# EAGLE design PCB (EAGLE 9.6.2)
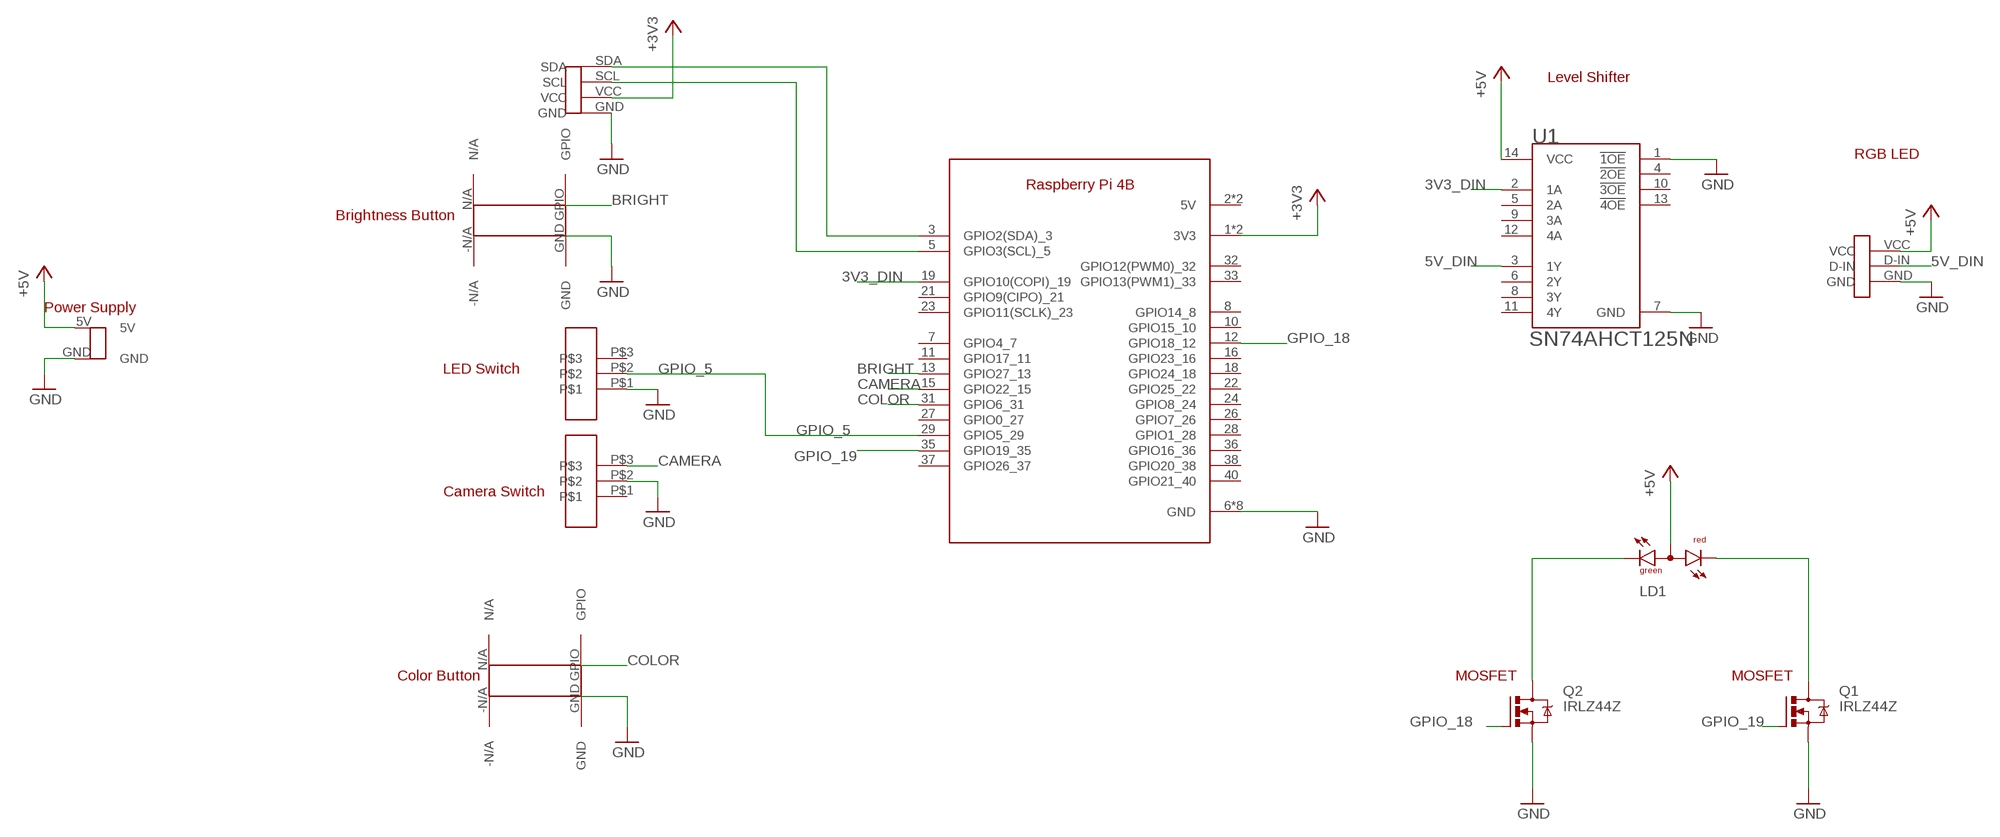
[diagram p0: schematic, sheet 1]

## Parts
LD1  DUOLED-RG-A  [DUOLED-A-5MM]
Q1  IRLZ44Z  [TO220BH]
Q2  IRLZ44Z  [TO220BH]
U1  TEXAS_INSTRUMENTS_SN74AHCT125NTEXAS_INSTRUMENTS_SN74AHCT125N_0_0  [TEXAS_INSTRUMENTS_SN74AHCT125N_0]
U$1  RASPBERRY_PI_4  [RASPI_4B]
U$2  G13-SW  [G13-SW]
U$3  G13-SW  [G13-SW]
U$4  LIGHTSENSOR-PO  [LIGHTSENSOR-IO]
U$5  LED-STRIP-PO  [LED-STRIP-PO]
U$6  G13-BUTTON  [G13-BUTTON]
U$7  G13-BUTTON  [G13-BUTTON]
U$8  G13-BATTERY  [G13-BATTERY]

## Nets
3V3_DIN: U1.2(1A) U$1.19(GPIO10(COPI)_19)
5V_DIN: U1.3(1Y) U$5.D-IN
+3V3: U$1.1(3V3) U$1.17(3V3) U$4.VCC
+5V: LD1.A U1.14(VCC) U$5.VCC U$8.5V
BRIGHT: U$1.13(GPIO27_13) U$6.GPIO
CAMERA: U$1.15(GPIO22_15) U$3.P$3
COLOR: U$1.31(GPIO6_31) U$7.GPIO
GND: Q1.S Q2.S U1.1(!1OE!) U1.7(GND) U$1.6(GND) U$1.9(GND) U$1.14(GND) U$1.20(GND) U$1.25(GND) U$1.30(GND) U$1.34(GND) U$1.39(GND) U$2.P$1 U$3.P$2 U$4.GND U$5.GND U$6.GND U$7.GND U$8.GND
GPIO_5: U$1.29(GPIO5_29) U$2.P$2
GPIO_18: Q2.G U$1.12(GPIO18_12)
GPIO_19: Q1.G U$1.35(GPIO19_35)
N$1: U$1.3(GPIO2(SDA)_3) U$4.SDA
N$2: U$1.5(GPIO3(SCL)_5) U$4.SCL
N$3: LD1.CR Q1.D
N$12: LD1.CX(CG) Q2.D
Unconnected: U1.4(!2OE!) U1.5(2A) U1.6(2Y) U1.8(3Y) U1.9(3A) U1.10(!3OE!) U1.11(4Y) U1.12(4A) U1.13(!4OE!) U$1.2(5V) U$1.4(5V) U$1.7(GPIO4_7) U$1.8(GPIO14_8) U$1.10(GPIO15_10) U$1.11(GPIO17_11) U$1.16(GPIO23_16) U$1.18(GPIO24_18) U$1.21(GPIO9(CIPO)_21) U$1.22(GPIO25_22) U$1.23(GPIO11(SCLK)_23) U$1.24(GPIO8_24) U$1.26(GPIO7_26) U$1.27(GPIO0_27) U$1.28(GPIO1_28) U$1.32(GPIO12(PWM0)_32) U$1.33(GPIO13(PWM1)_33) U$1.36(GPIO16_36) U$1.37(GPIO26_37) U$1.38(GPIO20_38) U$1.40(GPIO21_40) U$2.P$3 U$3.P$1 U$6.-N/A U$6.N/A U$7.-N/A U$7.N/A

## Notes on the sheet
- Level Shifter
- RGB LED
- Brightness Button
- Power Supply
- LED Switch
- Camera Switch
- Color Button | MOSFET | MOSFET

## Library data of the parts
LD1 = led:DUOLED-RG-A: DUO LED 2 colors (red/green), 5 mm, round, common Anode www.ligitek.com or other producers.
Q1 Q2 = transistor-power:IRLZ44Z: N-Channel HEXFET® Power MOSFET Logic Level AUTOMOTIVE MOSFET Source: http://www.irf.com/product-info/datasheets/data/irlz44zpbf.pdf
U1 = Texas Instruments - SN74AHCT125N:TEXAS_INSTRUMENTS_SN74AHCT125N: QUADRUPLE BUS BUFFER GATES WITH 3-STATE OUTPUTS; CENTROID_NOT_SPECIFIED: No; DATASHEET: http://www.ti.com/lit/ds/symlink/sn74ahct125.pdf; DIGIKEY_DESCRIPTION: IC BUS BUFFER TRI-ST QD 14DIP; DIGIKEY_PART_NUMBER: 296-4655-5-ND; IPC_LAND_PATTERN_NAME: DIP794W46P254L1930H508Q14; LEAD_FREE: yes; MF: Texas Instruments; MOUSER_PART_NUMBER: 595-SN74AHCT125N; MPN: SN74AHCT125N; PACKAGE: PDIP-14; PREFIX: U; ROHS: yes; TEMPERATURE_RANGE_HIGH: +125°C; TEMPERATURE_RANGE_LOW: -40°C
U$1 = raspberryPi4:RASPBERRY_PI_4
U$2 U$3 = raspberryPi4:G13-SW
U$4 = raspberryPi4:LIGHTSENSOR-PO
U$5 = raspberryPi4:LED-STRIP-PO
U$6 U$7 = sumayyah:G13-BUTTON
U$8 = raspberryPi4:G13-BATTERY

## Board
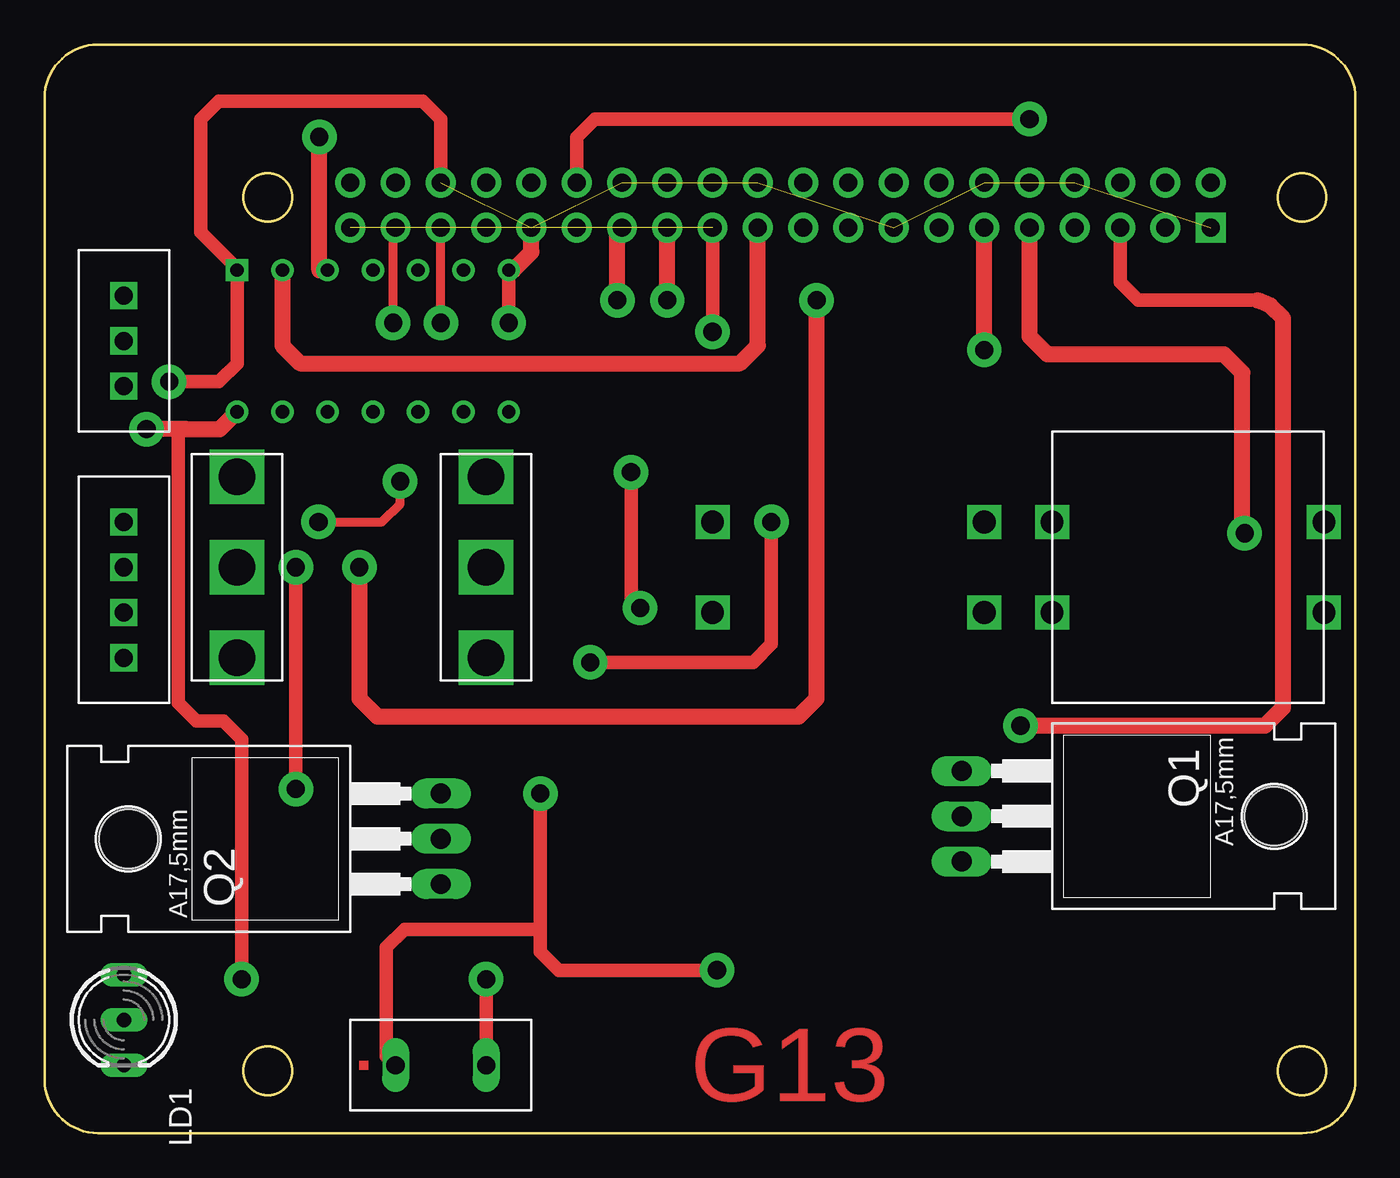
[diagram p1: board, top side]
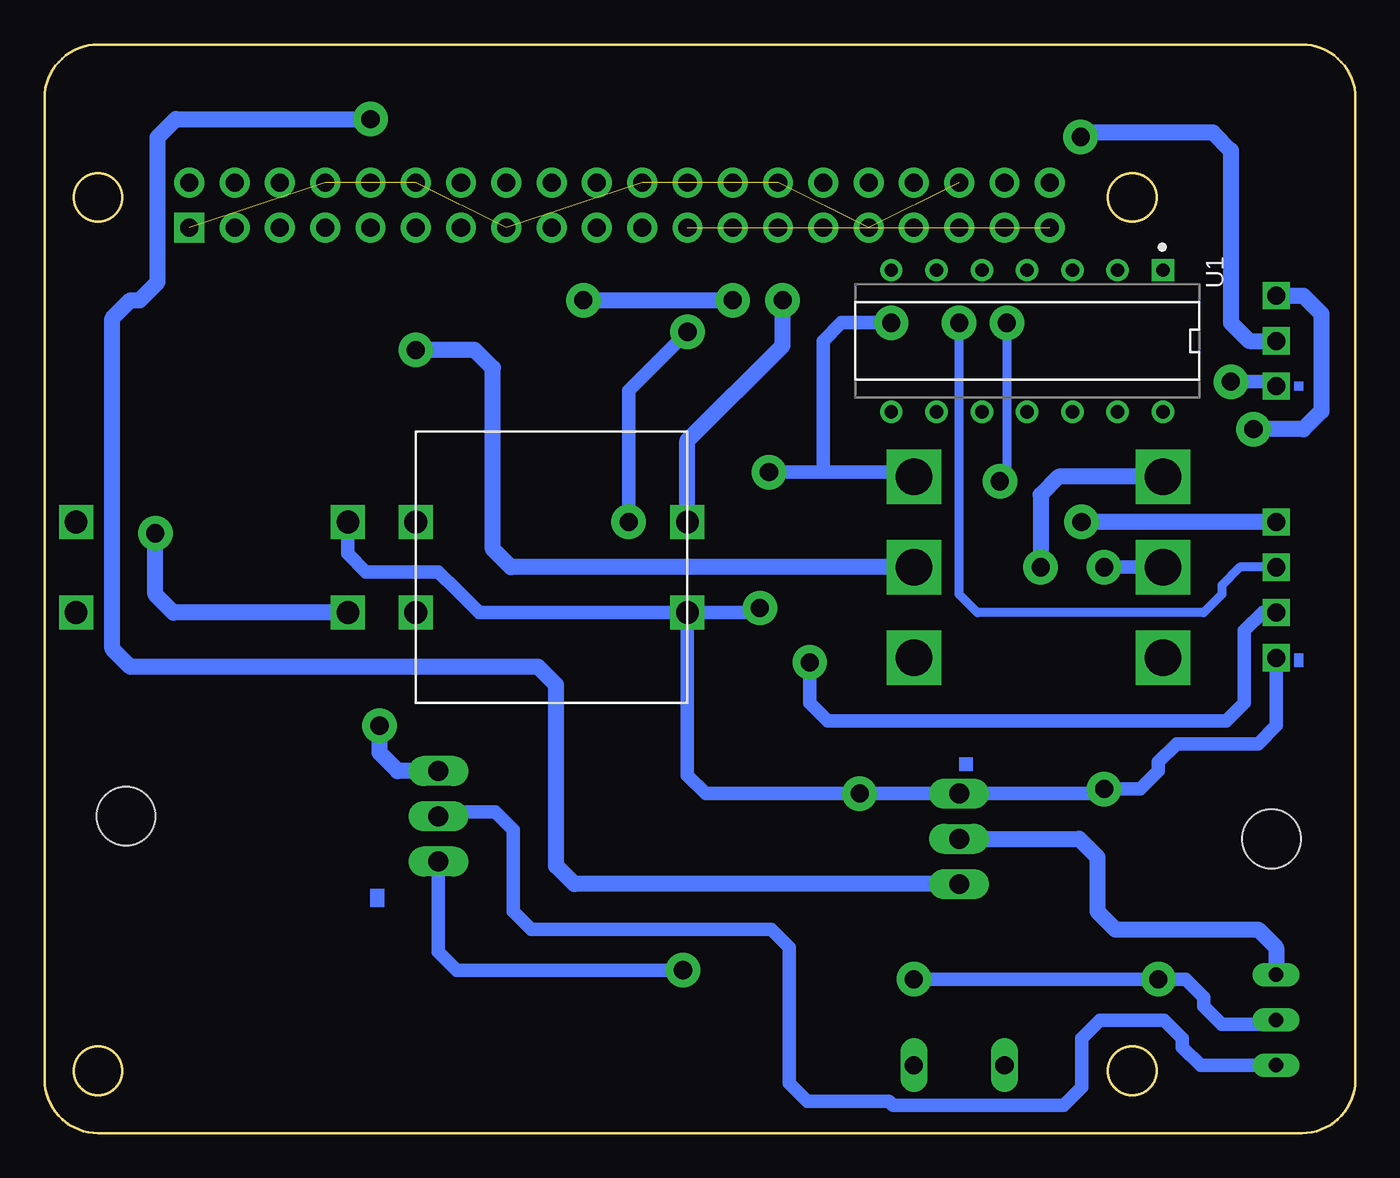
[diagram p2: board, bottom side, seen from below]

Size 73.52 x 61.08 mm. Coordinates in mm from the lower left corner, seen from the top.
Outline: 73.52,3 73.52,58.08 arc90 70.53,61.08 3,61.08 arc90 0,58.08 0,3 arc90 3,0 70.52,0 arc90 73.52,3
Outline: circle at 70.52,52.5 radius 1.35
Outline: circle at 70.52,3.5 radius 1.35
Outline: circle at 12.53,52.5 radius 1.35
Outline: circle at 12.53,3.5 radius 1.35
Copper layers (1*16): Top 0.035mm / dielectric 1.5mm / Bottom 0.035mm
Design rules "default": minimum track width 6mil, minimum drill 0.35mm, track to track 6mil, track to pad 6mil, pad to pad 6mil, via to via 6mil, smd to smd 6mil, copper to edge 40mil, drill to drill 6mil, minimum pad ring 10mil, minimum via ring 8mil, stop-mask expansion 4mil, vias tented up to drill 0mil, thermal gap 10mil

### Footprints (pad centres in the part's own frame; a part is rotated, then mirrored left to right if it is on the bottom)
DUOLED-A-5MM = drill 0.813 long: A 0,0; CR 2.54,0; CX -2.54,0
TO220BH = drill 1.118 long: D 0,-6.35; G -2.54,-6.35; S 2.54,-6.35 | hole 3.302: 0,11.176
TEXAS_INSTRUMENTS_SN74AHCT125N_0 = drill 0.75 pad 1.25 square: 1 -3.97,7.62 | drill 0.75 pad 1.25: 2 -3.97,5.08; 3 -3.97,2.54; 4 -3.97,0; 5 -3.97,-2.54; 6 -3.97,-5.08; 7 -3.97,-7.62; 8 3.97,-7.62; 9 3.97,-5.08; 10 3.97,-2.54; 11 3.97,0; 12 3.97,2.54; 13 3.97,5.08; 14 3.97,7.62
RASPI_4B = drill 1.016 pad 1.676: 1 -24.13,-1.27; 2 -24.13,1.27; 3 -21.59,-1.27; 4 -21.59,1.27; 5 -19.05,-1.27; 6 -19.05,1.27; 7 -16.51,-1.27; 8 -16.51,1.27; 9 -13.97,-1.27; 10 -13.97,1.27; 11 -11.43,-1.27; 12 -11.43,1.27; 13 -8.89,-1.27; 14 -8.89,1.27; 15 -6.35,-1.27; 16 -6.35,1.27; 17 -3.81,-1.27; 18 -3.81,1.27; 19 -1.27,-1.27; 20 -1.27,1.27; 21 1.27,-1.27; 22 1.27,1.27; 23 3.81,-1.27; 24 3.81,1.27; 25 6.35,-1.27; 26 6.35,1.27; 27 8.89,-1.27; 28 8.89,1.27; 29 11.43,-1.27; 30 11.43,1.27; 31 13.97,-1.27; 32 13.97,1.27; 33 16.51,-1.27; 34 16.51,1.27; 35 19.05,-1.27; 36 19.05,1.27; 37 21.59,-1.27; 38 21.59,1.27; 40 24.13,1.27 | drill 1.016 pad 1.676 square: 39 24.13,-1.27
G13-SW = drill 2.032 square: P$1 -5.08,0; P$2 0,0; P$3 5.08,0
LIGHTSENSOR-IO = drill 1.016 square: GND -5.08,0; SCL 0,0; SDA 2.54,0; VCC -2.54,0
LED-STRIP-PO = drill 1.016 square: D-IN 0,0; GND -2.54,0; VCC 2.54,0
G13-BUTTON = drill 1.27 square: -N/A -7.62,-2.54; GND 7.62,-2.54; GPIO 7.62,2.54; N/A -7.62,2.54
G13-BATTERY = drill 1.016 long: 5V -2.54,0; GND 2.54,0

### Placement (x,y rotation side)
LD1  4.45,6.35 270 top
Q1  57.79,17.78 270 top
Q2  15.88,16.51 90 top
U1  18.41,44.45 270 bottom
U$1  41.27,52.07 0 top
U$2  24.76,31.75 270 top
U$3  10.79,31.75 90 top
U$4  4.45,31.75 90 top
U$5  4.45,44.45 90 top
U$6  45.09,31.75 0 bottom
U$7  64.13,31.75 180 top
U$8  22.22,3.81 180 top

### Tracks (layer width: path | path; a pad name or v marks a point on that pad's centre or on a via)
3V3_DIN
  Top 0.889: U1.2 13.34,44.2 14.35,43.18 38.99,43.18 40.01,44.2 U$1.19
5V_DIN  (via drill 1.02 pad 1.93)
  Top 0.889: U1.3 15.41,48.42 v15.41,55.9
  Bottom 0.889: v15.41,55.9 15.16,56.15 8,56.15 6.99,55.13 6.99,45.47 5.97,44.45 U$5.D-IN
+3V3  (via drill 1.02 pad 1.93)  (1 unrouted)
  Top 0.762: U$1.17 v37.47,44.96 | v40.77,34.29 40.77,27.43 39.75,26.42 v30.61,26.42
  Bottom 0.762: v37.47,44.96 40.77,41.66 v40.77,34.29 | v30.61,26.42 30.61,24.13 29.59,23.11 7.24,23.11 6.22,24.13 6.22,28.19 5.21,29.21 U$4.VCC
+5V  (via drill 1.02 pad 1.93)
  Top 0.762: U$8.5V v24.76,8.64 | v11.05,8.64 11.05,22.1 10.03,23.11 8.51,23.11 7.49,24.13 7.49,39.5 8,39.5
  Top 0.889: U1.14 9.81,39.5 8,39.5 v5.71,39.5
  Bottom 0.762: v24.76,8.64 v11.05,8.64 9.53,8.64 8.51,7.62 8.51,7.11 7.49,6.1 4.45,6.1 LD1.A
  Bottom 0.889: U$5.VCC 2.92,46.99 1.91,45.97 1.91,40.51 2.92,39.5 v5.71,39.5
BRIGHT  (via drill 1.02 pad 1.93)
  Top 0.889: v32.13,46.74 32.13,50.8 U$1.13
  Bottom 0.889: U$6.GPIO 37.47,38.86 32.13,44.2 v32.13,46.74
CAMERA  (via drill 1.02 pad 1.93)
  Top 0.889: v17.65,31.75 17.65,24.38 18.67,23.37 42.29,23.37 43.31,24.38 v43.31,46.74 | v34.93,46.74 U$1.15
  Bottom 0.889: U$3.P$3 16.64,36.83 17.65,35.81 v17.65,31.75 | v43.31,46.74 v34.93,46.74
COLOR  (via drill 1.02 pad 1.93)
  Top 0.889: v67.31,33.66 67.18,33.66 67.18,42.67 66.17,43.69 56.26,43.69 55.25,44.7 U$1.31
  Bottom 0.889: U$7.GPIO 66.29,29.21 67.31,30.23 v67.31,33.66
GND  (via drill 1.02 pad 1.93)  (7 unrouted)
  Top 0.762: U$8.GND 19.18,4.32 19.18,10.41 20.19,11.43 27.81,11.43 | 27.81,11.43 v27.81,19.05 | v33.4,29.46 32.89,29.46 v32.89,37.08 | U1.7 v26.04,45.47 | v37.72,9.14 28.83,9.14 27.81,10.16 27.81,11.43 | v6.99,42.16 9.78,42.16 10.79,43.18 U1.1 10.79,48.51 9.78,49.53 8.76,50.55 8.76,56.9 9.78,57.91 21.21,57.91 22.22,56.9 U$1.6 | v14.1,19.3 v14.1,31.75
  Top 0.889: U1.7 26.29,48.42 27.3,49.44 U$1.9
  Bottom 0.762: U$6.GND 37.47,20.07 36.45,19.05 v27.81,19.05 Q2.S 14.1,19.05 v14.1,19.3 12.06,19.3 11.05,20.32 11.05,20.83 10.03,21.84 5.46,21.84 4.45,22.86 U$4.GND | U$6.GND 33.4,29.21 v33.4,29.46 | v32.89,37.08 29.84,37.08 | 29.84,37.08 24.76,37.08 U$2.P$1 | 29.84,37.08 29.84,44.45 28.83,45.47 v26.04,45.47 | Q1.S 51.44,10.16 50.42,9.14 v37.72,9.14 | U$7.GND 56.52,32.51 55.5,31.5 51.44,31.5 50.42,30.48 49.15,29.21 U$6.GND | U$5.GND 4.45,42.16 v6.99,42.16 | v14.1,31.75 U$3.P$2
GPIO_5  (via drill 1.02 pad 1.93)
  Top 0.889: v52.71,43.94 U$1.29
  Bottom 0.889: U$2.P$2 47.37,31.75 48.39,32.77 48.39,42.93 49.4,43.94 v52.71,43.94
GPIO_18  (via drill 1.02 pad 1.93)
  Top 0.762: v55.25,56.9 30.86,56.9 29.84,55.88 U$1.12
  Bottom 0.889: Q2.G 43.82,13.97 44.83,14.99 44.83,25.15 45.85,26.16 68.71,26.16 69.72,27.18 69.72,45.72 68.71,46.74 68.2,46.74 67.18,47.75 67.18,55.88 66.17,56.9 v55.25,56.9
GPIO_19  (via drill 1.02 pad 1.93)
  Top 0.762: 68.03,46.74 61.34,46.74 60.33,47.75 U$1.35
  Top 0.889: v54.74,22.86 68.45,22.86 69.47,23.88 69.47,45.72 68.75,46.44 68.03,46.74
  Bottom 0.889: Q1.G 53.72,20.32 54.74,21.34 v54.74,22.86
N$1  (via drill 1.02 pad 1.93)
  Top 0.508: v15.37,34.29 18.92,34.29 19.94,35.31 v19.94,36.58 | v19.55,45.47 19.55,50.8 U$1.3
  Bottom 0.508: v19.55,45.47 19.55,36.96 v19.94,36.58
  Bottom 0.889: U$4.SDA v15.37,34.29
N$2  (via drill 1.02 pad 1.93)
  Top 0.508: v22.22,45.47 U$1.5
  Bottom 0.508: U$4.SCL 6.48,31.75 7.49,30.73 7.49,30.23 8.51,29.21 21.21,29.21 22.22,30.23 v22.22,45.47
N$3
  Bottom 0.762: LD1.CR 8.69,3.81 9.7,4.83 9.7,5.31 10.72,6.32 14.33,6.32 15.35,5.31 15.35,2.56 16.36,1.55 25.93,1.55 26.16,1.78 30.73,1.78 31.75,2.79 31.75,10.41 32.77,11.43 46.23,11.43 47.24,12.45 47.24,17.02 48.26,18.03 51.44,18.03 Q1.D
N$12
  Bottom 0.889: Q2.D 15.49,16.51 14.48,15.49 14.48,12.45 13.46,11.43 5.46,11.43 4.45,10.41 LD1.CX
(copper drawn outside any net)
  shapes: Bottom area x4, Top area x1

### Text on the board
Top: G13